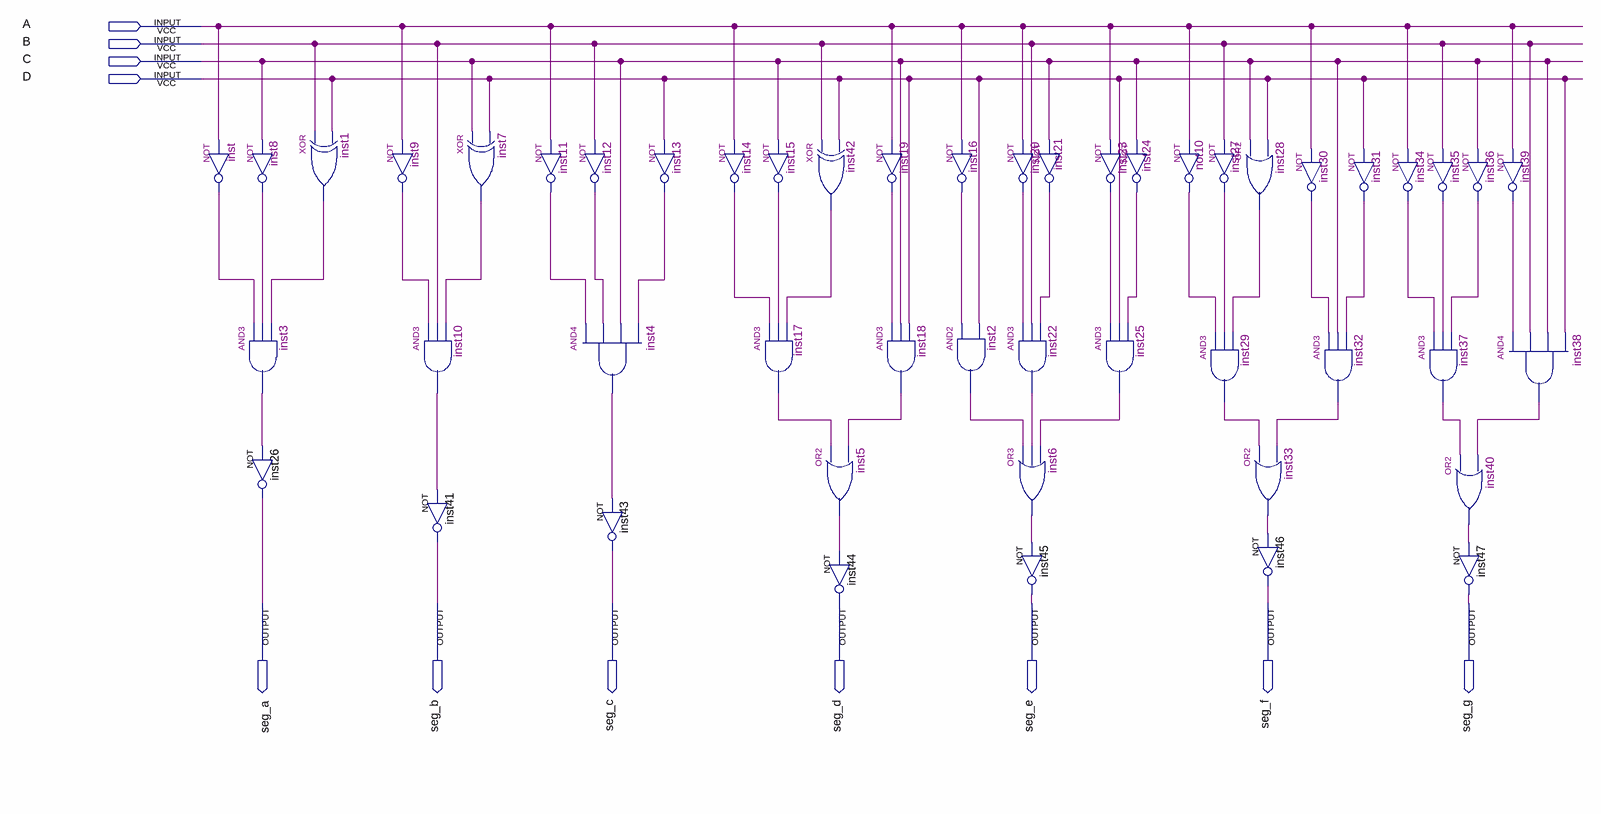
[diagram p0: schematic sheet]
// Quartus schematic bcd.bdf as structural Verilog: 49 symbols, 11 pins
module bcd (
  input  A,
  input  B,
  input  C,
  input  D,
  output seg_a,
  output seg_b,
  output seg_c,
  output seg_d,
  output seg_e,
  output seg_f,
  output seg_g
);

  wire inst1_out, inst2_out, inst3_out, inst4_out, inst5_out, inst6_out, inst7_out, inst8_out, inst9_out,
       inst10_out, inst11_out, inst12_out, inst13_out, inst14_out, inst15_out, inst16_out, inst17_out,
       inst18_out, inst19_out, inst20_out, inst21_out, inst22_out, inst23_out, inst24_out, inst25_out,
       inst27_out, inst28_out, inst29_out, inst30_out, inst31_out, inst32_out, inst33_out, inst34_out,
       inst35_out, inst36_out, inst37_out, inst38_out, inst39_out, inst40_out, inst42_out, inst_out,
       not10_out;

  not inst (inst_out, A);
  xor inst1 (inst1_out, B, D);
  not inst8 (inst8_out, C);
  and inst3 (inst3_out, inst_out, inst8_out, inst1_out);
  not inst26 (seg_a, inst3_out);
  not inst9 (inst9_out, A);
  and inst10 (inst10_out, inst9_out, B, inst7_out);
  not inst41 (seg_b, inst10_out);
  xor inst7 (inst7_out, C, D);
  not inst11 (inst11_out, A);
  not inst12 (inst12_out, B);
  and inst4 (inst4_out, inst11_out, inst12_out, C, inst13_out);
  not inst13 (inst13_out, D);
  not inst43 (seg_c, inst4_out);
  not inst14 (inst14_out, A);
  not inst15 (inst15_out, C);
  and inst17 (inst17_out, inst14_out, inst15_out, inst42_out);
  xor inst42 (inst42_out, B, D);
  or inst5 (inst5_out, inst17_out, inst18_out);
  not inst44 (seg_d, inst5_out);
  not inst19 (inst19_out, A);
  and inst18 (inst18_out, inst19_out, C, D);
  not inst16 (inst16_out, A);
  and inst2 (inst2_out, inst16_out, D);
  not inst20 (inst20_out, A);
  not inst21 (inst21_out, C);
  and inst22 (inst22_out, inst20_out, B, inst21_out);
  or inst6 (inst6_out, inst2_out, inst22_out, inst25_out);
  not inst45 (seg_e, inst6_out);
  not inst23 (inst23_out, A);
  not inst24 (inst24_out, C);
  and inst25 (inst25_out, inst23_out, D, inst24_out);
  not inst27 (inst27_out, B);
  not not10 (not10_out, A);
  and inst29 (inst29_out, not10_out, inst27_out, inst28_out);
  or inst28 (inst28_out, C, D);
  or inst33 (inst33_out, inst29_out, inst32_out);
  not inst46 (seg_f, inst33_out);
  not inst30 (inst30_out, A);
  not inst31 (inst31_out, D);
  and inst32 (inst32_out, inst30_out, C, inst31_out);
  not inst34 (inst34_out, A);
  and inst37 (inst37_out, inst34_out, inst35_out, inst36_out);
  not inst35 (inst35_out, B);
  not inst36 (inst36_out, C);
  or inst40 (inst40_out, inst37_out, inst38_out);
  not inst47 (seg_g, inst40_out);
  not inst39 (inst39_out, A);
  and inst38 (inst38_out, inst39_out, B, C, D);
endmodule
